# EAGLE board SnowMaker_V1.0 (EAGLE 8.3.2), part 1 of 3
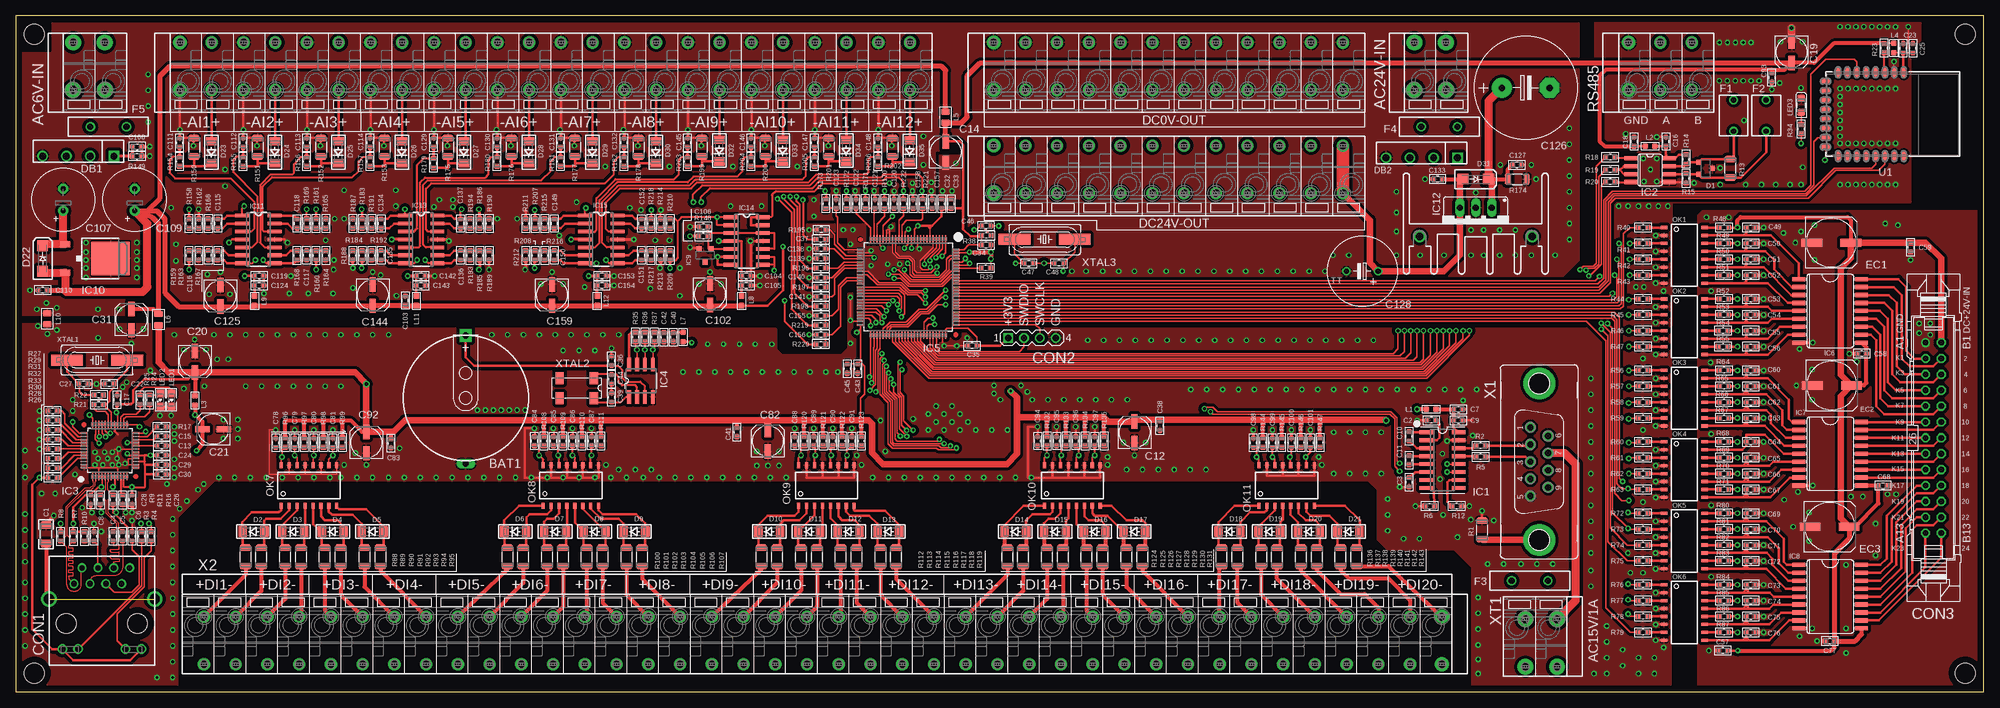
[diagram p7: board, top side]
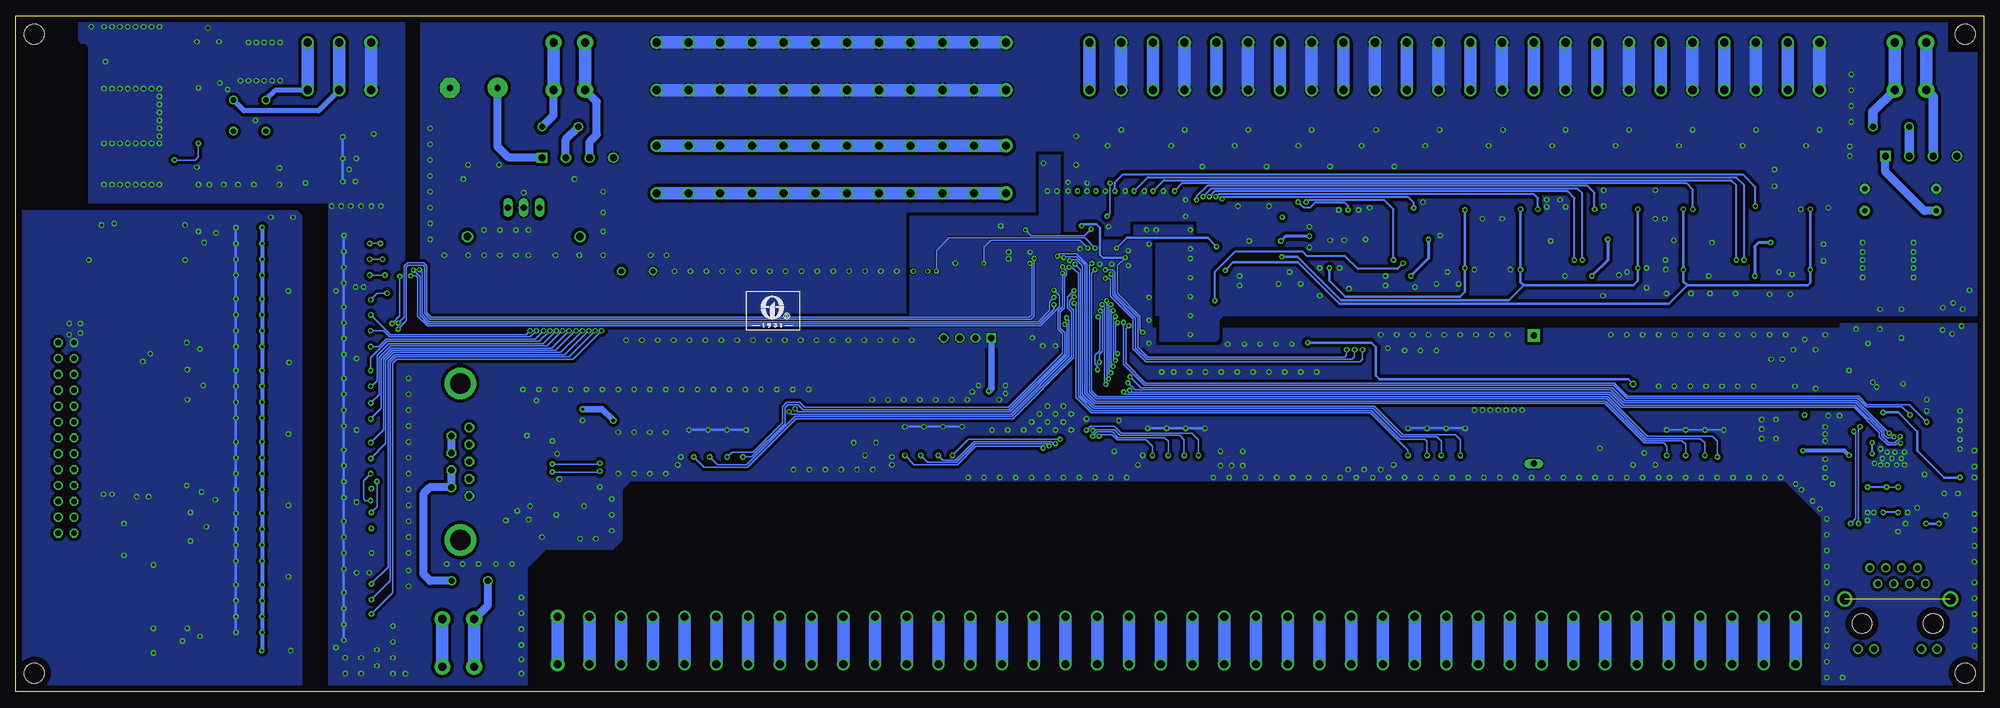
[diagram p8: board, bottom side, seen from below]

Size 315 x 108.2 mm. Coordinates in mm from the lower left corner, seen from the top.
Copper layers (1*16): Top 0.035mm / dielectric 1.5mm / Bottom 0.035mm
Design rules "default *": minimum track width 6mil, minimum drill 0.35mm, track to track 6mil, track to pad 6mil, pad to pad 6mil, via to via 6mil, smd to smd 6mil, copper to edge 40mil, drill to drill 6mil, minimum pad ring 10mil, minimum via ring 8mil, stop-mask expansion 4mil, vias tented up to drill 20mil, thermal gap 10mil

## Footprints (pad centres in the part's own frame; a part is rotated, then mirrored left to right if it is on the bottom)
CR2032-HF = drill 1 pad 1.93 square: B+ 10,0 | drill 1 long: B- -10.5,0
C1206 = smd 1.21 x 1.82: 1 -1.45,0; 2 1.45,0
C0603 = smd 0.8 x 0.75: 1 -0.75,0; 2 0.75,0
UD-5X5,8_NICHICON = smd 2.3 x 1: + 1.725,0; - -1.7,0
E3,5-10 = drill 0.813 pad 1.6: + -1.778,0 | drill 0.813 pad 1.6 octagon: - 1.778,0
E7,5-16 = drill 1.016 pad 3.15: + -3.81,0 | drill 1.016 pad 3.15 octagon: - 3.81,0
TT5D11 = drill 0.813: + -2.54,0 | drill 0.813 octagon: - 2.54,0
HY951180A = drill 0.89: 1 4.445,-6.35; 2 3.175,-8.89; 3 1.905,-6.35; 4 0.635,-8.89; 5 -0.635,-6.35; 6 -1.905,-8.89; 7 -3.175,-6.35; 8 -4.445,-8.89 | drill 1.02: 9 6.325,4.11; 10 3.785,4.11; 11 -3.785,4.11; 12 -6.325,4.11 | drill 1.63: SS@1 -8.45,-3.9; SS@2 8.45,-3.9 | hole 3.2: -5.715,0; 5.715,0
PINHEAD-4P = drill 1.016 square: 1 -3.81,0 | drill 1.016: 2 -1.27,0; 3 1.27,0; 4 3.81,0
26V = drill 0.914: A1 -15.24,-1.27 | drill 0.914 octagon: A2 -12.7,-1.27; A3 -10.16,-1.27; A4 -7.62,-1.27; A5 -5.08,-1.27; A6 -2.54,-1.27; A7 0,-1.27; A8 2.54,-1.27; A9 5.08,-1.27; A10 7.62,-1.27; A11 10.16,-1.27; A12 12.7,-1.27; A13 15.24,-1.27; B1 -15.24,1.27; B2 -12.7,1.27; B3 -10.16,1.27; B4 -7.62,1.27; B5 -5.08,1.27; B6 -2.54,1.27; B7 0,1.27; B8 2.54,1.27; B9 5.08,1.27; B10 7.62,1.27; B11 10.16,1.27; B12 12.7,1.27; B13 15.24,1.27
SOT23-3 = smd 0.78 x 0.78: 1 -0.95,-1.1; 2 0.95,-1.1; 3 0,1.1
MINI_MELF(LL-34) = smd 1.3 x 1.7: A 1.75,0; C -1.75,0
SMA-DO214AC = smd 1.8 x 1.7: A -2.05,0; C 2.05,0
KBP2005 = drill 1.1: AC1 -1.905,0; AC2 1.905,0; DC- 5.715,0 | drill 1.1 square: DC+ -5.715,0
UD-8X10_NICHICON = smd 3.3 x 1.3: + 3.125,0; - -3.125,0
TRF250-120T = drill 0.85: 1 -2.5,0; 2 2.5,0
RXEF110 = drill 1: 1 -2.9,0; 2 2.9,0
HS_TO-220-B = drill 1.2: SS@1 -9,2.1; SS@2 9,2.1
SO16 = smd 0.6 x 2.2: 1 -4.445,-2.6; 2 -3.175,-2.6; 3 -1.905,-2.6; 4 -0.635,-2.6; 5 0.635,-2.6; 6 1.905,-2.6; 7 3.175,-2.6; 8 4.445,-2.6; 9 4.445,2.6; 10 3.175,2.6; 11 1.905,2.6; 12 0.635,2.6; 13 -0.635,2.6; 14 -1.905,2.6; 15 -3.175,2.6; 16 -4.445,2.6
SO08 = smd 0.66 x 2.032: 1 -1.905,-3.073; 2 -0.635,-3.073; 3 0.635,-3.073; 4 1.905,-3.073; 5 1.905,3.073; 6 0.635,3.073; 7 -0.635,3.073; 8 -1.905,3.073
LQFP48_7X7_0.5P = smd 0.3 x 1.26: 1 -2.75,-4.13; 2 -2.25,-4.13; 3 -1.75,-4.13; 4 -1.25,-4.13; 5 -0.75,-4.13; 6 -0.25,-4.13; 7 0.25,-4.13; 8 0.75,-4.13; 9 1.25,-4.13; 10 1.75,-4.13; 11 2.25,-4.13; 12 2.75,-4.13; 25 2.75,4.13; 26 2.25,4.13; 27 1.75,4.13; 28 1.25,4.13; 29 0.75,4.13; 30 0.25,4.13; 31 -0.25,4.13; 32 -0.75,4.13; 33 -1.25,4.13; 34 -1.75,4.13; 35 -2.25,4.13; 36 -2.75,4.13 | smd 1.26 x 0.3: 13 4.13,-2.75; 14 4.13,-2.25; 15 4.13,-1.75; 16 4.13,-1.25; 17 4.13,-0.75; 18 4.13,-0.25; 19 4.13,0.25; 20 4.13,0.75; 21 4.13,1.25; 22 4.13,1.75; 23 4.13,2.25; 24 4.13,2.75; 37 -4.13,2.75; 38 -4.13,2.25; 39 -4.13,1.75; 40 -4.13,1.25; 41 -4.13,0.75; 42 -4.13,0.25; 43 -4.13,-0.25; 44 -4.13,-0.75; 45 -4.13,-1.25; 46 -4.13,-1.75; 47 -4.13,-2.25; 48 -4.13,-2.75
SOIC-8 = smd 0.6 x 2.2: 1 -1.905,-2.6; 2 -0.635,-2.6; 3 0.635,-2.6; 4 1.905,-2.6; 5 1.905,2.6; 6 0.635,2.6; 7 -0.635,2.6; 8 -1.905,2.6
LQFP100_14X14MM = smd 0.3 x 1.26: 1 -6,-7.63; 2 -5.5,-7.63; 3 -5,-7.63; 4 -4.5,-7.63; 5 -4,-7.63; 6 -3.5,-7.63; 7 -3,-7.63; 8 -2.5,-7.63; 9 -2,-7.63; 10 -1.5,-7.63; 11 -1,-7.63; 12 -0.5,-7.63; 13 0,-7.63; 14 0.5,-7.63; 15 1,-7.63; 16 1.5,-7.63; 17 2,-7.63; 18 2.5,-7.63; 19 3,-7.63; 20 3.5,-7.63; 21 4,-7.63; 22 4.5,-7.63; 23 5,-7.63; 24 5.5,-7.63; 25 6,-7.63; 51 6,7.63; 52 5.5,7.63; 53 5,7.63; 54 4.5,7.63; 55 4,7.63; 56 3.5,7.63; 57 3,7.63; 58 2.5,7.63; 59 2,7.63; 60 1.5,7.63; 61 1,7.63; 62 0.5,7.63; 63 0,7.63; 64 -0.5,7.63; 65 -1,7.63; 66 -1.5,7.63; 67 -2,7.63; 68 -2.5,7.63; 69 -3,7.63; 70 -3.5,7.63; 71 -4,7.63; 72 -4.5,7.63; 73 -5,7.63; 74 -5.5,7.63; 75 -6,7.63 | smd 1.26 x 0.3: 26 7.63,-6; 27 7.63,-5.5; 28 7.63,-5; 29 7.63,-4.5; 30 7.63,-4; 31 7.63,-3.5; 32 7.63,-3; 33 7.63,-2.5; 34 7.63,-2; 35 7.63,-1.5; 36 7.63,-1; 37 7.63,-0.5; 38 7.63,0; 39 7.63,0.5; 40 7.63,1; 41 7.63,1.5; 42 7.63,2; 43 7.63,2.5; 44 7.63,3; 45 7.63,3.5; 46 7.63,4; 47 7.63,4.5; 48 7.63,5; 49 7.63,5.5; 50 7.63,6; 76 -7.63,6; 77 -7.63,5.5; 78 -7.63,5; 79 -7.63,4.5; 80 -7.63,4; 81 -7.63,3.5; 82 -7.63,3; 83 -7.63,2.5; 84 -7.63,2; 85 -7.63,1.5; 86 -7.63,1; 87 -7.63,0.5; 88 -7.63,0; 89 -7.63,-0.5; 90 -7.63,-1; 91 -7.63,-1.5; 92 -7.63,-2; 93 -7.63,-2.5; 94 -7.63,-3; 95 -7.63,-3.5; 96 -7.63,-4; 97 -7.63,-4.5; 98 -7.63,-5; 99 -7.63,-5.5; 100 -7.63,-6
SO18W = smd 0.66 x 2.032: 1 -5.08,-5.029; 2 -3.81,-5.029; 3 -2.54,-5.029; 4 -1.27,-5.029; 5 0,-5.029; 6 1.27,-5.029; 7 2.54,-5.029; 8 3.81,-5.029; 9 5.08,-5.029; 10 5.08,5.029; 11 3.81,5.029; 12 2.54,5.029; 13 1.27,5.029; 14 0,5.029; 15 -1.27,5.029; 16 -2.54,5.029; 17 -3.81,5.029; 18 -5.08,5.029
TO252 = smd 1 x 1.6: 1 -2.28,-4.8; 2 2.28,-4.8 | smd 5.4 x 6.2: 3 0,2.5
SOIC-14 = smd 0.6 x 2.2: 1 -3.81,-2.6; 2 -2.54,-2.6; 3 -1.27,-2.6; 4 0,-2.6; 5 1.27,-2.6; 6 2.54,-2.6; 7 3.81,-2.6; 8 3.81,2.6; 9 2.54,2.6; 10 1.27,2.6; 11 0,2.6; 12 -1.27,2.6; 13 -2.54,2.6; 14 -3.81,2.6
78XXS = drill 1.016 long: GND 0,-2.54; IN -2.54,-2.54; OUT 2.54,-2.54
L0603 = smd 0.889 x 0.889: 1 -0.762,0; 2 0.762,0
L0805 = smd 1.016 x 1.397: 1 -0.889,0; 2 0.889,0
SML0805 = smd 1.2 x 1.2: A 1.05,0; C -1.05,0
LED0805 = smd 1.15 x 1.3: A 1.125,0; C -1.125,0
MINI-FLAT-16 = smd 1 x 0.5: 1 -3.24,4.445; 2 -3.24,3.175; 3 -3.24,1.905; 4 -3.24,0.635; 5 -3.24,-0.635; 6 -3.24,-1.905; 7 -3.24,-3.175; 8 -3.24,-4.445; 9 3.24,-4.445; 10 3.24,-3.175; 11 3.24,-1.905; 12 3.24,-0.635; 13 3.24,0.635; 14 3.24,1.905; 15 3.24,3.175; 16 3.24,4.445
R1206 = smd 1.05 x 1.77: 1 -1.485,0; 2 1.485,0
R0603 = smd 0.89 x 0.96: 1 -0.755,0; 2 0.755,0
LQ-BTM2540 = smd 1.6 x 0.8: 1 -6.687,1.758; 2 -6.687,0.258; 3 -6.687,-1.242; 4 -6.687,-2.743; 5 -6.687,-4.242; 6 -6.687,-5.742; 7 -6.687,-7.242; 8 -6.687,-8.742; 17 6.713,-8.742; 18 6.713,-7.242; 19 6.713,-5.742; 20 6.713,-4.242; 21 6.713,-2.743; 22 6.713,-1.242; 23 6.713,0.258; 24 6.713,1.758 | smd 0.8 x 1.6: 9 -5.249,-10.742; 10 -3.749,-10.742; 11 -2.249,-10.742; 12 -0.749,-10.742; 13 0.751,-10.742; 14 2.251,-10.742; 15 3.751,-10.742; 16 5.251,-10.742
SNOWMAKER_V1_OUTLINE = hole 3.2: 3,3; 3,105.2; 312,105.2; 312,3
F09VP = drill 1.016 octagon: 1 5.486,1.422; 2 2.743,1.422; 3 0,1.422; 4 -2.743,1.422; 5 -5.486,1.422; 6 4.115,-1.422; 7 1.372,-1.422; 8 -1.372,-1.422; 9 -4.115,-1.422 | drill 3.302 pad 5.08: G1 -12.522,0; G2 12.522,0
FFKDS/V1-5,08-1_FIRST = drill 1.3: 1@1 0.96,2.77; 2@1 0.96,-4.85
FFKDS/V1-5,08-1_MIDDLE = drill 1.3: 1@1 0.96,2.77; 2@1 0.96,-4.85
FFKDS/V1-5,08-1_LAST = drill 1.3 pad 2.184: 1@1 0.96,2.77; 2@1 0.96,-4.85
FFKDS/V1-5.08-2 = drill 1.3 pad 2.54: 1@1 -1.58,2.77; 1@2 -1.58,-4.85; 2@1 3.5,2.77; 2@2 3.5,-4.85
FFKDS/V1-5.08-3 = drill 1.3: 1@1 0.96,2.77; 1@2 0.96,-4.85; 2@1 6.04,2.77; 2@2 6.04,-4.85 | drill 1.3 pad 2.184: 3@1 11.12,2.77; 3@2 11.12,-4.85
SM49 = smd 5.08 x 1.778: 1 -4.826,0; 2 4.826,0
MC306 = smd 1.3 x 1.9: 1 -2.75,-1.6; 2 2.75,-1.6; 3 2.75,1.6; 4 -2.75,1.6

## Placement (x,y rotation side)
BAT1  CR2032/1HF  [CR2032-HF]  72.03,47.02 90 top
C1  1nF/2kV  [C1206]  4.87,25.22 90 top
C2  100nF/50V  [C0603]  226.57,43.43 180 top
C3  100nF/50V  [C0603]  223.01,33.53 270 top
C4  6.8nF/50V  [C0603]  15.59,24.89 90 top
C5  6.8nF/50V  [C0603]  17.11,24.89 90 top
C6  10nF/50V  [C0603]  18.63,24.89 90 top
C7  10uF/16V  [C0603]  230.89,45.21 0 top
C8  22nF/50V  [C0603]  12.54,24.89 90 top
C9  100nF/50V  [C0603]  230.89,43.43 0 top
C10  100nF/50V  [C0603]  223.01,40.89 90 top
C11  100nF/50V  [C0603]  223.01,37.08 90 top
C12  100uF/6.3V 5x5.8  [UD-5X5,8_NICHICON]  179.07,41.53 90 top
C13  4.7uF/10V  [C0603]  23.37,39.37 0 top
C14  100uF/6.3V 5x5.8  [UD-5X5,8_NICHICON]  148.84,86.36 90 top
C15  10nF/50V  [C0603]  23.37,40.89 0 top
C16  100nF/50V  [C0603]  264.11,88.06 90 top
C17  100nF/50V  [C0603]  16.26,46.74 90 top
C18  100nF/50V  [C0603]  259.03,88.06 90 top
C19  100uF/6.3V 5x5.8  [UD-5X5,8_NICHICON]  284.23,102.36 270 top
C20  100uF/6.3V 5x5.8  [UD-5X5,8_NICHICON]  28.7,52.83 270 top
C21  100uF/6.3V 5x5.8  [UD-5X5,8_NICHICON]  31.62,42.04 180 top
C22  18pF/50V  [C0603]  14.95,49.28 180 top
C23  10uF/16V  [C0603]  302.1,103 90 top
C24  100nF/50V  [C0603]  23.37,37.85 0 top
C25  100nF/50V  [C0603]  303.62,103 90 top
C26  100nF/50V  [C0603]  18.63,30.73 270 top
C27  18pF/50V  [C0603]  10.89,49.28 0 top
C28  100nF/50V  [C0603]  12.03,30.73 270 top
C29  100nF/50V  [C0603]  23.37,36.32 0 top
C30  10uF/16V  [C0603]  23.37,34.8 0 top
C31  100uF/6.3V 5x5.8  [UD-5X5,8_NICHICON]  18.54,59.56 90 top
C32  100nF/50V  [C0603]  148.21,78.11 90 top
C33  100nF/50V  [C0603]  149.73,78.11 90 top
C34  100nF/50V  [C0603]  155.32,71.5 0 top
C35  100nF/50V  [C0603]  153.07,55.37 180 top
C36  100nF/50V  [C0603]  95.38,52.96 90 top
C37  100nF/50V  [C0603]  128.94,73.91 180 top
C38  100nF/50V  [C0603]  183.13,42.58 270 top
C39  6.8pF/50V/NP0  [C0603]  95.38,47.12 90 top
C40  100nF/50V  [C0603]  105.28,56.77 270 top
C41  100nF/50V  [C0603]  115.44,41.56 270 top
C42  10uF/16V  [C0603]  103.76,56.77 270 top
C43  100nF/50V  [C0603]  134.75,51.72 270 top
C44  6.8pF/50V/NP0  [C0603]  95.38,50.04 270 top
C45  100nF/50V  [C0603]  133.1,51.72 270 top
C46  100nF/50V  [C0603]  155.32,74.55 0 top
C47  18pF/50V/NP0  [C0603]  162.14,68.58 0 top
C48  18pF/50V/NP0  [C0603]  166.97,68.58 180 top
C49  10nF/50V  [C0603]  277.71,74.3 0 top
C50  10nF/50V  [C0603]  277.71,71.75 0 top
C51  10nF/50V  [C0603]  277.71,69.22 0 top
C52  10nF/50V  [C0603]  277.71,66.67 0 top
C53  10nF/50V  [C0603]  277.71,62.87 0 top
C54  10nF/50V  [C0603]  277.71,60.33 0 top
C55  10nF/50V  [C0603]  277.71,57.78 0 top
C56  10nF/50V  [C0603]  277.71,55.24 0 top
C57  100nF/50V  [C0603]  273.21,6.6 180 top
C58  100nF/50V  [C0603]  295.44,54.1 180 top
C59  100nF/50V  [C0603]  303.28,71.12 270 top
C60  10nF/50V  [C0603]  277.71,51.44 0 top
C61  10nF/50V  [C0603]  277.71,48.9 0 top
C62  10nF/50V  [C0603]  277.71,46.35 0 top
C63  10nF/50V  [C0603]  277.71,43.81 0 top
C64  10nF/50V  [C0603]  277.71,40.01 0 top
C65  10nF/50V  [C0603]  277.71,37.47 0 top
C66  10nF/50V  [C0603]  277.71,34.92 0 top
C67  10nF/50V  [C0603]  277.71,32.38 0 top
C68  100nF/50V  [C0603]  298.87,33.02 0 top
C69  10nF/50V  [C0603]  277.71,28.57 0 top
C70  10nF/50V  [C0603]  277.71,26.04 0 top
C71  10nF/50V  [C0603]  277.71,23.5 0 top
C72  10nF/50V  [C0603]  277.71,20.95 0 top
C73  10nF/50V  [C0603]  277.71,17.14 0 top
C74  10nF/50V  [C0603]  277.71,14.61 0 top
C75  10nF/50V  [C0603]  277.71,12.06 0 top
C76  10nF/50V  [C0603]  277.71,9.53 0 top
C77  100nF/50V  [C0603]  290.32,8.13 180 top
C78  10nF/50V  [C0603]  41.62,39.88 90 top
C79  10nF/50V  [C0603]  44.67,39.88 90 top
C80  10nF/50V  [C0603]  47.72,39.88 90 top
C81  10nF/50V  [C0603]  50.77,39.88 90 top
C82  100uF/6.3V 5x5.8  [UD-5X5,8_NICHICON]  120.4,40.13 90 top
C83  10nF/50V  [C0603]  60.07,39.75 270 top
C84  10nF/50V  [C0603]  83.02,40.13 90 top
C85  10nF/50V  [C0603]  86.07,40.13 90 top
C86  10nF/50V  [C0603]  89.12,40.13 90 top
C87  10nF/50V  [C0603]  92.17,40.13 90 top
C88  10nF/50V  [C0603]  124.68,40.13 90 top
C89  10nF/50V  [C0603]  127.73,40.13 90 top
C90  10nF/50V  [C0603]  130.78,40.13 90 top
C91  10nF/50V  [C0603]  133.82,40.13 90 top
C92  100uF/6.3V 5x5.8  [UD-5X5,8_NICHICON]  56.13,39.88 90 top
C93  10nF/50V  [C0603]  281.05,98.3 270 top
C94  10nF/50V  [C0603]  163.54,40.13 90 top
C95  10nF/50V  [C0603]  166.59,40.13 90 top
C96  10nF/50V  [C0603]  169.64,40.13 90 top
C97  10nF/50V  [C0603]  172.69,40.13 90 top
C98  10nF/50V  [C0603]  198.09,39.88 90 top
C99  10nF/50V  [C0603]  201.13,39.88 90 top
C100  10nF/50V  [C0603]  204.18,39.88 90 top
C101  10nF/50V  [C0603]  207.23,39.88 90 top
C102  47uF/6.3V 5x5.8  [UD-5X5,8_NICHICON]  111.12,63.63 270 top
C103  10nF/50V  [C0603]  62.36,62.61 90 top
C104  100nF/50V  [C0603]  116.93,66.55 0 top
C105  10uF/16V  [C0603]  116.93,65.02 0 top
C106  100nF/50V  [C0603]  110.07,74.42 180 top
C107  1000uF/16V_M10*16  [E3,5-10]  7.62,78.74 90 top
C108  100nF/50V  [C0603]  19.43,87.25 0 top
C109  220uF/16V_M10*16  [E3,5-10]  19.05,78.74 90 top
C110  100nF/50V  [C0603]  4.32,64.26 180 top
C111  100nF/50V  [C0603]  26.25,87.88 90 top
C112  100nF/50V  [C0603]  36.41,87.88 90 top
C113  100nF/50V  [C0603]  46.57,87.88 90 top
C114  100nF/50V  [C0603]  56.73,87.88 90 top
C115  30pF/50V  [C0603]  32.35,74.93 270 top
C116  30pF/50V  [C0603]  30.83,69.85 90 top
C117  30pF/50V  [C0603]  46.57,69.85 90 top
C118  30pF/50V  [C0603]  45.05,74.93 270 top
C119  100nF/50V  [C0603]  38.95,66.55 0 top
C120  1nF/50V  [C0603]  140.59,78.11 90 top
C121  1nF/50V  [C0603]  137.54,78.11 90 top
C122  1nF/50V  [C0603]  134.49,78.11 90 top
C123  1nF/50V  [C0603]  131.32,78.11 90 top
C124  10uF/16V  [C0603]  38.95,65.02 0 top
C125  47uF/6.3V 5x5.8  [UD-5X5,8_NICHICON]  32.77,63.37 270 top
C126  2200uF/50V_M16*25  [E7,5-16]  241.68,96.65 0 top
C127  100nF/50V  [C0603]  240.28,84.33 0 top
C128  [TT5D11]  215.52,67.31 180 top
C129  100nF/50V  [C0603]  66.89,87.88 90 top
C130  100nF/50V  [C0603]  77.05,87.88 90 top
C131  100nF/50V  [C0603]  87.21,87.88 90 top
C132  100nF/50V  [C0603]  97.37,87.88 90 top
C133  100nF/50V  [C0603]  227.58,82.04 180 top
C134  30pF/50V  [C0603]  58.51,74.93 270 top
C135  30pF/50V  [C0603]  58.51,69.85 90 top
C136  30pF/50V  [C0603]  71.21,69.85 90 top
C137  30pF/50V  [C0603]  71.21,74.93 270 top
C138  1nF/50V  [C0603]  128.87,70.87 180 top
C139  1nF/50V  [C0603]  128.87,69.34 180 top
C140  1nF/50V  [C0603]  128.87,66.29 180 top
C141  1nF/50V  [C0603]  128.87,63.25 180 top
C142  100nF/50V  [C0603]  64.86,66.55 0 top
C143  10uF/16V  [C0603]  64.86,65.02 0 top
C144  47uF/6.3V 5x5.8  [UD-5X5,8_NICHICON]  57.15,63.5 270 top
C145  100nF/50V  [C0603]  107.53,87.88 90 top
C146  100nF/50V  [C0603]  117.69,87.88 90 top
C147  100nF/50V  [C0603]  127.85,87.88 90 top
C148  100nF/50V  [C0603]  138.01,87.88 90 top
C149  30pF/50V  [C0603]  86.2,74.93 270 top
C150  30pF/50V  [C0603]  86.2,69.85 90 top
C151  30pF/50V  [C0603]  100.17,69.85 90 top
C152  30pF/50V  [C0603]  100.17,74.93 270 top
C153  100nF/50V  [C0603]  93.82,66.55 0 top
C154  10uF/16V  [C0603]  93.82,65.02 0 top
C155  1nF/50V  [C0603]  128.87,60.2 180 top
C156  1nF/50V  [C0603]  128.87,57.15 180 top
C157  1nF/50V  [C0603]  146.69,78.11 90 top
C158  1nF/50V  [C0603]  143.64,78.11 90 top
C159  47uF/6.3V 5x5.8  [UD-5X5,8_NICHICON]  85.85,63.5 270 top
CON1  HR951180A  [HY951180A]  13.8,10.95 180 top
CON2  SWJ  [PINHEAD-4P]  162.65,56.64 0 top
CON3  [26V]  306.92,40.64 270 top
D1  SM712-02H  [SOT23-3]  270.46,83.77 270 top
D2  1N4148  [MINI_MELF(LL-34)]  38.06,25.65 0 top
D3  1N4148  [MINI_MELF(LL-34)]  44.41,25.65 0 top
D4  1N4148  [MINI_MELF(LL-34)]  50.77,25.65 0 top
D5  1N4148  [MINI_MELF(LL-34)]  57.12,25.65 0 top
D6  1N4148  [MINI_MELF(LL-34)]  79.97,25.65 0 top
D7  1N4148  [MINI_MELF(LL-34)]  86.33,25.65 0 top
D8  1N4148  [MINI_MELF(LL-34)]  92.67,25.65 0 top
D9  1N4148  [MINI_MELF(LL-34)]  99.03,25.65 0 top
D10  1N4148  [MINI_MELF(LL-34)]  120.61,25.65 0 top
D11  1N4148  [MINI_MELF(LL-34)]  126.97,25.65 0 top
D12  1N4148  [MINI_MELF(LL-34)]  133.31,25.65 0 top
D13  1N4148  [MINI_MELF(LL-34)]  139.66,25.65 0 top
D14  1N4148  [MINI_MELF(LL-34)]  159.99,25.65 0 top
D15  1N4148  [MINI_MELF(LL-34)]  166.34,25.65 0 top
D16  1N4148  [MINI_MELF(LL-34)]  172.69,25.65 0 top
D17  1N4148  [MINI_MELF(LL-34)]  179.03,25.65 0 top
D18  1N4148  [MINI_MELF(LL-34)]  194.28,25.65 0 top
D19  1N4148  [MINI_MELF(LL-34)]  200.62,25.65 0 top
D20  1N4148  [MINI_MELF(LL-34)]  206.97,25.65 0 top
D21  1N4148  [MINI_MELF(LL-34)]  213.32,25.65 0 top
D22  1N4007  [SMA-DO214AC]  4.32,69.34 90 top
D23  1N4148  [MINI_MELF(LL-34)]  31.33,86.36 90 top
D24  1N4148  [MINI_MELF(LL-34)]  41.49,86.36 90 top
D25  1N4148  [MINI_MELF(LL-34)]  51.65,86.36 90 top
D26  1N4148  [MINI_MELF(LL-34)]  61.81,86.36 90 top
D27  1N4148  [MINI_MELF(LL-34)]  71.72,86.36 90 top
D28  1N4148  [MINI_MELF(LL-34)]  82.13,86.36 90 top
D29  1N4148  [MINI_MELF(LL-34)]  92.29,86.36 90 top
D30  1N4148  [MINI_MELF(LL-34)]  102.45,86.36 90 top
D31  1N4007  [SMA-DO214AC]  233.68,82.04 0 top
D32  1N4148  [MINI_MELF(LL-34)]  112.61,86.61 90 top
D33  1N4148  [MINI_MELF(LL-34)]  122.77,86.61 90 top
D34  1N4148  [MINI_MELF(LL-34)]  132.93,86.61 90 top
D35  1N4148  [MINI_MELF(LL-34)]  143.09,86.49 90 top
DB1  KBP2005G  [KBP2005]  10.03,85.72 180 top
DB2  KBP2005G  [KBP2005]  225.04,85.47 180 top
EC1  220uF/50V  [UD-8X10_NICHICON]  290.58,71.88 0 top
EC2  220uF/50V  [UD-8X10_NICHICON]  290.67,49.02 0 top
EC3  220uF/50V  [UD-8X10_NICHICON]  290.32,26.42 0 top
F1  TRF250-120T  [TRF250-120T]  274.95,92.2 270 top
F2  TRF250-120T  [TRF250-120T]  280.16,92.2 270 top
F3  RXEF110  [RXEF110]  242.32,17.78 0 top
F4  RXEF110  [RXEF110]  227.84,90.42 180 top
F5  RXEF110  [RXEF110]  14.86,90.42 180 top
HS1  HEATSINK  [HS_TO-220-B]  233.68,74.93 180 top
IC1  ST3232BD  [SO16]  228.35,37.08 270 top
IC2  ST3485EBD  [SO08]  261.57,83.48 270 top
IC3  W5500  [LQFP48_7X7_0.5P]  15.08,38.61 0 top
IC4  SD2068  [SOIC-8]  100.08,49.78 0 top
IC5  STM32F103VCT6  [LQFP100_14X14MM]  142.84,64.77 180 top
IC6  ULN2803  [SO18W]  290.41,60.96 270 top
IC7  ULN2803  [SO18W]  290.41,38.1 270 top
IC8  ULN2803  [SO18W]  290.41,15.24 270 top
IC9  LM4040AIM3X-2.5  [SOT23-3]  110.33,69.85 180 top
IC10  LM1117IDTX-3.3  [TO252]  12.7,69.34 270 top
IC11  SGM8584XS14  [SOIC-14]  38.87,72.39 270 top
IC12  LM78M24  [78XXS]  233.68,74.93 180 top
IC13  SGM8584XS14  [SOIC-14]  64.91,72.39 270 top
IC14  SGM8584XS14  [SOIC-14]  117,72.14 270 top
IC15  SGM8584XS14  [SOIC-14]  93.75,72.39 270 top
L1  600R/100MHz  [L0603]  226.57,45.21 180 top
L2  600R/100MHz  [L0603]  261.57,87.29 180 top
L3  100R/100MHz 3A  [L0603]  28.7,46.61 270 top
L4  600R/100MHz  [L0603]  300.57,103 270 top
L5  100R/100MHz  [L0805]  148.84,91.95 270 top
L6  100R/100MHz  [L0805]  22.86,59.56 270 top
L7  600R/100MHz  [L0603]  106.81,56.77 90 top
L8  10uH  [L0603]  116.2,62.58 270 top
L9  10uH  [L0603]  38.23,62.58 90 top
L10  100R/100MHz  [L0805]  5.04,59.69 90 top
L11  10uH  [L0603]  64.14,62.58 90 top
L12  10uH  [L0603]  93.09,62.58 90 top
LED1  [SML0805]  24.94,46.7 90 top
LED2  [SML0805]  23.16,46.7 90 top
LED3  [LED0805]  285.75,93.85 270 top
LOGO1  SY-LOGO_BOTTOM  [SY-LOGO_BOTTOM]  193.77,61.34 0 top
OK1  TLP283-4  [MINI-FLAT-16]  267.05,69.85 0 top
OK2  TLP283-4  [MINI-FLAT-16]  267.05,58.42 0 top
OK3  TLP283-4  [MINI-FLAT-16]  267.05,46.99 0 top
OK4  TLP283-4  [MINI-FLAT-16]  267.05,35.56 0 top
OK5  TLP283-4  [MINI-FLAT-16]  267.05,24.13 0 top
OK6  TLP283-4  [MINI-FLAT-16]  267.05,12.7 0 top
OK7  TLP283-4  [MINI-FLAT-16]  46.95,33.02 90 top
OK8  TLP283-4  [MINI-FLAT-16]  88.86,33.02 90 top
OK9  TLP283-4  [MINI-FLAT-16]  129.76,33.02 90 top
OK10  TLP283-4  [MINI-FLAT-16]  169.13,33.02 90 top
OK11  TLP283-4  [MINI-FLAT-16]  203.42,33.02 90 top
R1  0R  [R1206]  234.7,25.91 270 top
R2  22R  [R0603]  234.44,39.37 180 top
R3  330R  [R0603]  20.16,24.89 90 top
R4  330R  [R0603]  21.68,24.89 90 top
R5  22R  [R0603]  234.44,37.59 180 top
R6  10k  [R0603]  226.31,29.72 0 top
R7  49R9  [R0603]  9.24,24.89 270 top
R8  49R9  [R0603]  7.2,24.89 270 top
R9  49R9  [R0603]  13.55,30.73 270 top
R10  10R  [R0603]  11.01,24.89 90 top
R11  49R9  [R0603]  15.59,30.73 270 top
R12  10k  [R0603]  230.63,29.72 180 top
R13  120R  [R1206]  274.4,83.77 90 top
R14  2.4k  [R0603]  267.33,85.22 90 top
R15  2.4k  [R0603]  267.33,82.18 90 top
R16  12.4k/1%  [R0603]  17.11,30.73 270 top
R17  10k  [R0603]  23.37,42.42 180 top
R18  0R  [R0603]  255.21,85.54 180 top
R19  0R  [R0603]  255.21,83.51 180 top
R20  0R  [R0603]  255.21,81.6 180 top
R21  1M  [R0603]  13.3,45.97 180 top
R22  0R  [R0603]  13.3,47.5 0 top
R23  10k  [R0603]  299.05,103 90 top
R24  330R  [R0603]  21.43,46.74 270 top
R25  330R  [R0603]  19.9,46.74 270 top
R26  10k  [R0603]  5.93,34.29 180 top
R27  10k  [R0603]  5.93,44.96 0 top
R28  10k  [R0603]  5.93,35.81 180 top
R29  10k  [R0603]  5.93,43.43 0 top
R30  10k  [R0603]  5.93,37.34 180 top
R31  10k  [R0603]  5.93,41.91 0 top
R32  10k  [R0603]  5.93,40.39 0 top
R33  10k  [R0603]  5.93,38.86 0 top
R34  1k  [R0603]  285.75,90.04 90 top
R35  10k  [R0603]  99.19,56.77 270 top
R36  10k  [R0603]  100.71,56.77 270 top
R37  10k  [R0603]  102.23,56.77 270 top
R38  10k  [R0603]  155.32,73.03 180 top
R39  10k  [R0603]  155.29,67.82 180 top
R40  330R  [R0603]  260.44,74.3 180 top
R41  330R  [R0603]  260.44,71.75 180 top
R42  330R  [R0603]  260.44,69.22 180 top
R43  330R  [R0603]  260.44,66.67 180 top
R44  330R  [R0603]  260.44,62.87 180 top
R45  330R  [R0603]  260.44,60.33 180 top
R46  330R  [R0603]  260.44,57.78 180 top
R47  330R  [R0603]  260.44,55.24 180 top
R48  20K  [R0603]  273.4,74.3 180 top
R49  20K  [R0603]  273.4,71.75 180 top
R50  20K  [R0603]  273.4,69.22 180 top
R51  20K  [R0603]  273.4,66.67 180 top
R52  20K  [R0603]  273.4,62.87 180 top
R53  20K  [R0603]  273.4,60.33 180 top
R54  20K  [R0603]  273.27,57.78 180 top
R55  20K  [R0603]  273.27,55.24 180 top
R56  330R  [R0603]  260.44,51.44 180 top
R57  330R  [R0603]  260.44,48.9 180 top
R58  330R  [R0603]  260.44,46.35 180 top
R59  330R  [R0603]  260.44,43.81 180 top
R60  330R  [R0603]  260.44,40.01 180 top
R61  330R  [R0603]  260.44,37.47 180 top
R62  330R  [R0603]  260.44,34.92 180 top
R63  330R  [R0603]  260.44,32.38 180 top
R64  20K  [R0603]  273.4,51.44 180 top
R65  20K  [R0603]  273.4,48.9 180 top
R66  20K  [R0603]  273.4,46.35 180 top
R67  20K  [R0603]  273.4,43.81 180 top
R68  20K  [R0603]  273.4,40.01 180 top
R69  20K  [R0603]  273.4,37.47 180 top
R70  20K  [R0603]  273.4,34.92 180 top
R71  20K  [R0603]  273.4,32.38 180 top
R72  330R  [R0603]  260.44,28.57 180 top
R73  330R  [R0603]  260.44,26.04 180 top
R74  330R  [R0603]  260.44,23.5 180 top
R75  330R  [R0603]  260.44,20.95 180 top
R76  330R  [R0603]  260.44,17.14 180 top
R77  330R  [R0603]  260.44,14.61 180 top
R78  330R  [R0603]  260.44,12.06 180 top
R79  330R  [R0603]  260.44,9.53 180 top
R80  20K  [R0603]  273.4,28.57 180 top
R81  20K  [R0603]  273.4,26.04 180 top
R82  20K  [R0603]  273.4,23.5 180 top
R83  20K  [R0603]  273.4,20.95 180 top
R84  20K  [R0603]  273.4,17.14 180 top
R85  20K  [R0603]  273.4,14.61 180 top
R86  20K  [R0603]  273.4,12.06 180 top
R87  20K  [R0603]  273.4,9.53 180 top
R88  2.2k  [R1206]  36.8,21.59 90 top
R89  2.2k  [R1206]  39.34,21.59 90 top
R90  2.2k  [R1206]  43.15,21.59 90 top
R91  2.2k  [R1206]  45.69,21.59 90 top
R92  2.2k  [R1206]  49.49,21.59 90 top
R93  2.2k  [R1206]  52.03,21.59 90 top
R94  2.2k  [R1206]  55.84,21.59 90 top
R95  2.2k  [R1206]  58.38,21.59 90 top
R96  10K  [R0603]  43.15,39.88 90 top
R97  10K  [R0603]  46.19,39.88 90 top
R98  10K  [R0603]  49.24,39.88 90 top
R99  10K  [R0603]  52.29,39.88 90 top
R100  2.2k  [R1206]  78.7,21.59 90 top
R101  2.2k  [R1206]  81.25,21.59 90 top
R102  2.2k  [R1206]  85.06,21.59 90 top
R103  2.2k  [R1206]  87.59,21.59 90 top
R104  2.2k  [R1206]  91.41,21.59 90 top
R105  2.2k  [R1206]  93.94,21.59 90 top
R106  2.2k  [R1206]  97.75,21.59 90 top
R107  2.2k  [R1206]  100.3,21.59 90 top
R108  10K  [R0603]  84.55,40.13 90 top
R109  10K  [R0603]  87.59,40.13 90 top
R110  10K  [R0603]  90.64,40.13 90 top
R111  10K  [R0603]  93.69,40.13 90 top
R112  2.2k  [R1206]  119.34,21.59 90 top
R113  2.2k  [R1206]  121.89,21.59 90 top
R114  2.2k  [R1206]  125.69,21.59 90 top
R115  2.2k  [R1206]  128.24,21.59 90 top
R116  2.2k  [R1206]  132.04,21.59 90 top
R117  2.2k  [R1206]  134.59,21.59 90 top
R118  2.2k  [R1206]  138.4,21.59 90 top
R119  2.2k  [R1206]  140.94,21.59 90 top
R120  10K  [R0603]  126.2,40.13 90 top
R121  10K  [R0603]  129.25,40.13 90 top
R122  10K  [R0603]  132.3,40.13 90 top
R123  10K  [R0603]  135.35,40.13 90 top
R124  2.2k  [R1206]  158.72,21.59 90 top
R125  2.2k  [R1206]  161.25,21.59 90 top
R126  2.2k  [R1206]  165.06,21.59 90 top
R127  2.2k  [R1206]  167.6,21.59 90 top
R128  2.2k  [R1206]  171.41,21.59 90 top
R129  2.2k  [R1206]  173.96,21.59 90 top
R130  2.2k  [R1206]  177.76,21.59 90 top
R131  2.2k  [R1206]  180.31,21.59 90 top
R132  10K  [R0603]  165.06,40.13 90 top
R133  10K  [R0603]  168.11,40.13 90 top
R134  10K  [R0603]  171.16,40.13 90 top
R135  10K  [R0603]  174.21,40.13 90 top
R136  2.2k  [R1206]  193,21.59 90 top
R137  2.2k  [R1206]  195.54,21.59 90 top
R138  2.2k  [R1206]  199.35,21.59 90 top
R139  2.2k  [R1206]  201.9,21.59 90 top
R140  2.2k  [R1206]  205.71,21.59 90 top
R141  2.2k  [R1206]  208.25,21.59 90 top
R142  2.2k  [R1206]  212.06,21.59 90 top
R143  2.2k  [R1206]  214.59,21.59 90 top
R144  10K  [R0603]  199.61,39.88 90 top
R145  10K  [R0603]  202.66,39.88 90 top
R146  10K  [R0603]  205.71,39.88 90 top
R147  10K  [R0603]  208.75,39.88 90 top
R148  10k  [R0603]  110.07,72.9 180 top
R149  10K  [R0603]  19.43,85.72 0 top
R150  120R/0.1%  [R1206]  28.54,87.12 270 top
R151  120R/0.1%  [R1206]  38.7,87.12 270 top
R152  120R/0.1%  [R1206]  48.86,87.12 270 top
R153  120R/0.1%  [R1206]  59.02,87.12 270 top
R154  10k  [R0603]  26.25,84.84 90 top
R155  10k  [R0603]  36.41,84.84 90 top
R156  10k  [R0603]  46.57,84.84 90 top
R157  10k  [R0603]  56.73,84.84 90 top
R158  5.11k/1%  [R0603]  27.78,74.93 90 top
R159  5.11k/1%  [R0603]  27.78,69.85 270 top
R160  5.11k/1%  [R0603]  48.1,69.85 270 top
R161  5.11k/1%  [R0603]  48.1,74.93 90 top
R162  124k/1%  [R0603]  29.3,74.93 270 top
R163  124k/1%  [R0603]  29.3,69.85 90 top
R164  124k/1%  [R0603]  49.62,69.85 90 top
R165  124k/1%  [R0603]  49.62,74.93 270 top
R166  1k/1%  [R0603]  30.83,74.93 90 top
R167  1k/1%  [R0603]  32.35,69.85 270 top
R168  1k/1%  [R0603]  45.05,69.85 90 top
R169  1k/1%  [R0603]  46.57,74.93 270 top
R170  1k  [R0603]  139.06,78.11 270 top
R171  1k  [R0603]  136.02,78.11 270 top
R172  1k  [R0603]  132.97,78.11 270 top
R173  1k  [R0603]  129.67,78.11 270 top
R174  20K  [R1206]  240.32,82.04 0 top
R175  120R/0.1%  [R1206]  69.18,87.12 270 top
R176  120R/0.1%  [R1206]  79.34,87.12 270 top
R177  120R/0.1%  [R1206]  89.5,87.12 270 top
R178  120R/0.1%  [R1206]  99.66,87.12 270 top
R179  10k  [R0603]  66.89,84.58 90 top
R180  10k  [R0603]  77.05,84.84 90 top
R181  10k  [R0603]  87.21,84.84 90 top
R182  10k  [R0603]  97.37,84.84 90 top
R183  5.11k/1%  [R0603]  55.46,74.93 90 top
R184  5.11k/1%  [R0603]  55.46,69.85 270 top
R185  5.11k/1%  [R0603]  74.26,69.85 270 top
R186  5.11k/1%  [R0603]  74.26,74.93 90 top
R187  124k/1%  [R0603]  53.94,74.93 270 top
R188  124k/1%  [R0603]  53.94,69.85 90 top
R189  124k/1%  [R0603]  75.78,69.85 90 top
R190  124k/1%  [R0603]  75.78,74.93 270 top
R191  1k/1%  [R0603]  56.99,74.93 270 top
R192  1k/1%  [R0603]  56.99,69.85 90 top
R193  1k/1%  [R0603]  72.74,69.85 90 top
R194  1k/1%  [R0603]  72.74,74.93 270 top
R195  1k  [R0603]  128.87,72.39 0 top
R196  1k  [R0603]  128.87,67.82 0 top
R197  1k  [R0603]  128.87,64.77 0 top
R198  1k  [R0603]  128.87,61.72 0 top
R199  120R/0.1%  [R1206]  109.82,87.12 270 top
R200  120R/0.1%  [R1206]  119.98,87.12 270 top
R201  120R/0.1%  [R1206]  130.14,87.12 270 top
R202  120R/0.1%  [R1206]  140.3,87.12 270 top
R203  10k  [R0603]  107.53,84.84 90 top
R204  10k  [R0603]  117.69,84.84 90 top
R205  10k  [R0603]  127.85,84.84 90 top
R206  10k  [R0603]  138.01,84.84 90 top
R207  5.11k/1%  [R0603]  83.15,74.93 90 top
R208  5.11k/1%  [R0603]  83.15,69.85 270 top
R209  5.11k/1%  [R0603]  104.74,69.85 270 top
R210  5.11k/1%  [R0603]  104.74,74.93 90 top
R211  124k/1%  [R0603]  81.63,74.93 270 top
R212  124k/1%  [R0603]  81.63,69.85 90 top
R213  124k/1%  [R0603]  103.22,69.85 90 top
R214  124k/1%  [R0603]  103.22,74.93 270 top
R215  1k/1%  [R0603]  84.67,74.93 270 top
R216  1k/1%  [R0603]  84.67,69.85 270 top
R217  1k/1%  [R0603]  101.69,69.85 270 top
R218  1k/1%  [R0603]  101.69,74.93 90 top
R219  1k  [R0603]  128.87,58.67 0 top
R220  1k  [R0603]  128.87,55.63 0 top
R221  1k  [R0603]  145.16,78.11 270 top
R222  1k  [R0603]  142.11,78.11 270 top
U1  LQ-BTM2540  [LQ-BTM2540]  300.41,92.44 270 top
U$1  [SNOWMAKER_V1_OUTLINE]  0,0 0 top
X1  [F09VP]  243.84,36.83 90 top
X2  FFKDS/V1-5.08_FIRST  [FFKDS/V1-5,08-1_FIRST]  29.18,9.27 0 top
X3  FFKDS/V1-5.08_MIDDLE  [FFKDS/V1-5,08-1_MIDDLE]  34.26,9.27 0 top
X4  FFKDS/V1-5.08_MIDDLE  [FFKDS/V1-5,08-1_MIDDLE]  39.34,9.27 0 top
X5  FFKDS/V1-5.08_MIDDLE  [FFKDS/V1-5,08-1_MIDDLE]  44.41,9.27 0 top
X6  FFKDS/V1-5.08_MIDDLE  [FFKDS/V1-5,08-1_MIDDLE]  49.49,9.27 0 top
X7  FFKDS/V1-5.08_MIDDLE  [FFKDS/V1-5,08-1_MIDDLE]  54.58,9.27 0 top
X8  FFKDS/V1-5.08_MIDDLE  [FFKDS/V1-5,08-1_MIDDLE]  59.66,9.27 0 top
X9  FFKDS/V1-5.08_MIDDLE  [FFKDS/V1-5,08-1_MIDDLE]  64.73,9.27 0 top
X10  FFKDS/V1-5.08_MIDDLE  [FFKDS/V1-5,08-1_MIDDLE]  69.81,9.27 0 top
X11  FFKDS/V1-5.08_MIDDLE  [FFKDS/V1-5,08-1_MIDDLE]  74.89,9.27 0 top
X12  FFKDS/V1-5.08_MIDDLE  [FFKDS/V1-5,08-1_MIDDLE]  79.97,9.27 0 top
X13  FFKDS/V1-5.08_MIDDLE  [FFKDS/V1-5,08-1_MIDDLE]  85.06,9.27 0 top
X14  FFKDS/V1-5.08_MIDDLE  [FFKDS/V1-5,08-1_MIDDLE]  90.14,9.27 0 top
X15  FFKDS/V1-5.08_MIDDLE  [FFKDS/V1-5,08-1_MIDDLE]  95.22,9.27 0 top
X16  FFKDS/V1-5.08_MIDDLE  [FFKDS/V1-5,08-1_MIDDLE]  100.3,9.27 0 top
X17  FFKDS/V1-5.08_MIDDLE  [FFKDS/V1-5,08-1_MIDDLE]  105.38,9.27 0 top
X18  FFKDS/V1-5.08_MIDDLE  [FFKDS/V1-5,08-1_MIDDLE]  110.45,9.27 0 top
X19  FFKDS/V1-5.08_MIDDLE  [FFKDS/V1-5,08-1_MIDDLE]  115.53,9.27 0 top
X20  FFKDS/V1-5.08_MIDDLE  [FFKDS/V1-5,08-1_MIDDLE]  120.61,9.27 0 top
X21  FFKDS/V1-5.08_MIDDLE  [FFKDS/V1-5,08-1_MIDDLE]  125.69,9.27 0 top
X22  FFKDS/V1-5.08_MIDDLE  [FFKDS/V1-5,08-1_MIDDLE]  130.78,9.27 0 top
X23  FFKDS/V1-5.08_MIDDLE  [FFKDS/V1-5,08-1_MIDDLE]  135.85,9.27 0 top
X24  FFKDS/V1-5.08_MIDDLE  [FFKDS/V1-5,08-1_MIDDLE]  140.94,9.27 0 top
X25  FFKDS/V1-5.08_MIDDLE  [FFKDS/V1-5,08-1_MIDDLE]  146.01,9.27 0 top
X26  FFKDS/V1-5.08_MIDDLE  [FFKDS/V1-5,08-1_MIDDLE]  151.09,9.27 0 top
X27  FFKDS/V1-5.08_MIDDLE  [FFKDS/V1-5,08-1_MIDDLE]  156.18,9.27 0 top
X28  FFKDS/V1-5.08_MIDDLE  [FFKDS/V1-5,08-1_MIDDLE]  161.25,9.27 0 top
X29  FFKDS/V1-5.08_MIDDLE  [FFKDS/V1-5,08-1_MIDDLE]  166.34,9.27 0 top
X30  FFKDS/V1-5.08_MIDDLE  [FFKDS/V1-5,08-1_MIDDLE]  171.41,9.27 0 top
X31  FFKDS/V1-5.08_MIDDLE  [FFKDS/V1-5,08-1_MIDDLE]  176.5,9.27 0 top
X32  FFKDS/V1-5.08_MIDDLE  [FFKDS/V1-5,08-1_MIDDLE]  181.57,9.27 0 top
X33  FFKDS/V1-5.08_MIDDLE  [FFKDS/V1-5,08-1_MIDDLE]  186.66,9.27 0 top
X34  FFKDS/V1-5.08_MIDDLE  [FFKDS/V1-5,08-1_MIDDLE]  191.74,9.27 0 top
X35  FFKDS/V1-5.08_MIDDLE  [FFKDS/V1-5,08-1_MIDDLE]  196.81,9.27 0 top
X36  FFKDS/V1-5.08_MIDDLE  [FFKDS/V1-5,08-1_MIDDLE]  201.9,9.27 0 top
X37  FFKDS/V1-5.08_MIDDLE  [FFKDS/V1-5,08-1_MIDDLE]  206.97,9.27 0 top
X38  FFKDS/V1-5.08_MIDDLE  [FFKDS/V1-5,08-1_MIDDLE]  212.06,9.27 0 top
X39  FFKDS/V1-5.08_MIDDLE  [FFKDS/V1-5,08-1_MIDDLE]  217.13,9.27 0 top
X40  FFKDS/V1-5.08_MIDDLE  [FFKDS/V1-5,08-1_MIDDLE]  222.22,9.27 0 top
X41  FFKDS/V1-5.08_LAST  [FFKDS/V1-5,08-1_LAST]  227.29,9.27 0 top
X42  FFKDS/V1-5.08_MIDDLE  [FFKDS/V1-5,08-1_MIDDLE]  32.35,99.06 180 top
X43  FFKDS/V1-5.08_LAST  [FFKDS/V1-5,08-1_LAST]  27.27,99.06 180 top
X44  FFKDS/V1-5.08_MIDDLE  [FFKDS/V1-5,08-1_MIDDLE]  42.51,99.06 180 top
X45  FFKDS/V1-5.08_MIDDLE  [FFKDS/V1-5,08-1_MIDDLE]  37.43,99.06 180 top
X46  FFKDS/V1-5.08_MIDDLE  [FFKDS/V1-5,08-1_MIDDLE]  52.67,99.06 180 top
X47  FFKDS/V1-5.08_MIDDLE  [FFKDS/V1-5,08-1_MIDDLE]  47.59,99.06 180 top
X48  FFKDS/V1-5.08_MIDDLE  [FFKDS/V1-5,08-1_MIDDLE]  62.83,99.06 180 top
X49  FFKDS/V1-5.08_MIDDLE  [FFKDS/V1-5,08-1_MIDDLE]  57.75,99.06 180 top
X50  FFKDS/V1-5.08_MIDDLE  [FFKDS/V1-5,08-1_MIDDLE]  72.99,99.06 180 top
X51  FFKDS/V1-5.08_MIDDLE  [FFKDS/V1-5,08-1_MIDDLE]  67.91,99.06 180 top
X52  FFKDS/V1-5.08_MIDDLE  [FFKDS/V1-5,08-1_MIDDLE]  83.15,99.06 180 top
X53  FFKDS/V1-5.08_MIDDLE  [FFKDS/V1-5,08-1_MIDDLE]  78.07,99.06 180 top
X54  FFKDS/V1-5.08_MIDDLE  [FFKDS/V1-5,08-1_MIDDLE]  93.31,99.06 180 top
X55  FFKDS/V1-5.08_MIDDLE  [FFKDS/V1-5,08-1_MIDDLE]  88.23,99.06 180 top
X56  FFKDS/V1-5.08_MIDDLE  [FFKDS/V1-5,08-1_MIDDLE]  103.47,99.06 180 top
X57  FFKDS/V1-5.08_MIDDLE  [FFKDS/V1-5,08-1_MIDDLE]  98.39,99.06 180 top
X58  FFKDS/V1-5.08_FIRST  [FFKDS/V1-5,08-1_FIRST]  213.36,82.55 180 top
X59  FFKDS/V1-5.08_MIDDLE  [FFKDS/V1-5,08-1_MIDDLE]  208.28,82.55 180 top
X60  FFKDS/V1-5.08_MIDDLE  [FFKDS/V1-5,08-1_MIDDLE]  203.2,82.55 180 top
X61  FFKDS/V1-5.08_MIDDLE  [FFKDS/V1-5,08-1_MIDDLE]  198.12,82.55 180 top
X62  FFKDS/V1-5.08_MIDDLE  [FFKDS/V1-5,08-1_MIDDLE]  193.04,82.55 180 top
X63  FFKDS/V1-5.08_MIDDLE  [FFKDS/V1-5,08-1_MIDDLE]  187.96,82.55 180 top
X64  FFKDS/V1-5.08_MIDDLE  [FFKDS/V1-5,08-1_MIDDLE]  182.88,82.55 180 top
X65  FFKDS/V1-5.08_MIDDLE  [FFKDS/V1-5,08-1_MIDDLE]  177.8,82.55 180 top
X66  FFKDS/V1-5.08_MIDDLE  [FFKDS/V1-5,08-1_MIDDLE]  172.72,82.55 180 top
X67  FFKDS/V1-5.08_MIDDLE  [FFKDS/V1-5,08-1_MIDDLE]  167.64,82.55 180 top
X68  FFKDS/V1-5.08_MIDDLE  [FFKDS/V1-5,08-1_MIDDLE]  162.56,82.55 180 top
X69  FFKDS/V1-5.08_LAST  [FFKDS/V1-5,08-1_LAST]  157.48,82.55 180 top
X70  FFKDS/V1-5.08_FIRST  [FFKDS/V1-5,08-1_FIRST]  213.36,99.06 180 top
X71  FFKDS/V1-5.08_MIDDLE  [FFKDS/V1-5,08-1_MIDDLE]  208.28,99.06 180 top
X72  FFKDS/V1-5.08_MIDDLE  [FFKDS/V1-5,08-1_MIDDLE]  203.2,99.06 180 top
X73  FFKDS/V1-5.08_MIDDLE  [FFKDS/V1-5,08-1_MIDDLE]  198.12,99.06 180 top
X74  FFKDS/V1-5.08_MIDDLE  [FFKDS/V1-5,08-1_MIDDLE]  193.04,99.06 180 top
X75  FFKDS/V1-5.08_MIDDLE  [FFKDS/V1-5,08-1_MIDDLE]  187.96,99.06 180 top
X76  FFKDS/V1-5.08_MIDDLE  [FFKDS/V1-5,08-1_MIDDLE]  182.88,99.06 180 top
X77  FFKDS/V1-5.08_MIDDLE  [FFKDS/V1-5,08-1_MIDDLE]  177.8,99.06 180 top
X78  FFKDS/V1-5.08_MIDDLE  [FFKDS/V1-5,08-1_MIDDLE]  172.72,99.06 180 top
X79  FFKDS/V1-5.08_MIDDLE  [FFKDS/V1-5,08-1_MIDDLE]  167.64,99.06 180 top
X80  FFKDS/V1-5.08_MIDDLE  [FFKDS/V1-5,08-1_MIDDLE]  162.56,99.06 180 top
X81  FFKDS/V1-5.08_LAST  [FFKDS/V1-5,08-1_LAST]  157.48,99.06 180 top
X82  FFKDS/V1-5.08_MIDDLE  [FFKDS/V1-5,08-1_MIDDLE]  113.63,99.06 180 top
X83  FFKDS/V1-5.08_MIDDLE  [FFKDS/V1-5,08-1_MIDDLE]  108.55,99.06 180 top
X84  FFKDS/V1-5.08_MIDDLE  [FFKDS/V1-5,08-1_MIDDLE]  123.79,99.06 180 top
X85  FFKDS/V1-5.08_MIDDLE  [FFKDS/V1-5,08-1_MIDDLE]  118.71,99.06 180 top
X86  FFKDS/V1-5.08_MIDDLE  [FFKDS/V1-5,08-1_MIDDLE]  133.95,99.06 180 top
X87  FFKDS/V1-5.08_MIDDLE  [FFKDS/V1-5,08-1_MIDDLE]  128.87,99.06 180 top
X88  FFKDS/V1-5.08_FIRST  [FFKDS/V1-5,08-1_FIRST]  144.11,99.06 180 top
X89  FFKDS/V1-5.08_MIDDLE  [FFKDS/V1-5,08-1_MIDDLE]  139.03,99.06 180 top
XT1  FFKDS/V1-5.08-2  [FFKDS/V1-5.08-2]  243.21,8.89 0 top
XT2  FFKDS/V1-5.08-3  [FFKDS/V1-5.08-3]  269.24,99.06 180 top
XT3  FFKDS/V1-5.08-2  [FFKDS/V1-5.08-2]  12.7,99.06 180 top
XT4  FFKDS/V1-5.08-2  [FFKDS/V1-5.08-2]  227.33,99.06 180 top
XTAL1  25MHz  [SM49]  13.05,53.09 180 top
XTAL2  MC-306 32.768000kHz 12.5 +20.0-20.0  [MC306]  89.79,48.59 180 top
XTAL3  8MHz  [SM49]  164.68,72.39 0 top

## Tracks (layer width: path | path; a pad name or v marks a point on that pad's centre or on a via)
1V20
  Top 0.254: IC3.22 22.08,40.36 C15.1
+3V3  (via drill 0.4, 0.4 pad 0.55, 0.45, 0.5, 0.6, 0.6 pad 0.55)
  Top 0.203: C38.1 183.21,43.33 183.39,43.51
  Top 0.254: IC3.28 16.33,44.52 v16.14,44.7 | 150.47,70.74 IC5.100 151.8,70.77 152.53,71.5 C34.1 154.57,72.9 R38.2 | L4.1 R23.2 | IC5.75 148.84,57.91 149.1,58.17 152.4,58.17 153.82,56.75 C35.1 | v137.41,69.47 137.11,69.77 IC5.28 132.92,69.77 131.06,71.63 131.06,73.15 130.3,73.91 C37.1 | C43.1 135.21,52.94 IC5.50 135.21,58.12 v134.62,57.53 | C45.1 C43.1 | IC5.11 143.84,73.99 v144.4,74.55 145.92,74.55 | C43.1 135.49,52.47 135.89,52.07 135.89,47.62 135.25,46.99 135.25,43.53 135.35,43.43 | 145.92,74.55 146.34,74.55 | IC5.6 146.34,73.91 146.34,74.13 | 146.34,74.2 146.34,74.55 | 146.34,74.55 146.69,74.55 146.34,74.2 | 146.34,74.13 146.34,74.2 | 146.34,74.13 145.92,74.55
  Top 0.406: CON1.12 18.36,5.08 9.24,5.08 CON1.9 7.46,6.86 5.84,6.86 2.67,10.03 2.67,33.15 v3.81,34.29 R26.2 R28.2 R30.2 | v16.14,44.7 16.14,45.88 C17.1 18.43,45.99 18.8,46.35 18.8,48.26 20.57,50.04 27.63,50.04 C20.+ 28.7,50.29 | C18.1 260.8,87.31 L2.2 | C33.1 151.27,77.36 151.64,77.72 | 151.64,77.72 151.64,87.5 151.06,88.08 C14.+ | 151.64,77.72 151.64,74.04 152.78,72.9 154.57,72.9 | v108.2,55.88 108.08,56.01 L7.1 | C35.1 157.57,55.37 CON2.1 | C32.1 148.21,76.07 146.69,74.55 v144.4,74.55
  Top 0.61: C20.+ L3.1 | R96.2 43.15,43.43 46.19,43.43 | R97.2 46.19,43.43 | 46.19,43.43 49.24,43.43 | 49.24,43.43 R98.2 | 49.24,43.43 52.29,43.43 | 52.29,43.43 R99.2 | 52.29,43.43 53.59,43.43 55.42,41.6 C92.+ | R109.2 87.59,43.43 | 84.58,43.43 84.58,40.89 R108.2 | R110.2 90.64,43.43 | R111.2 93.69,43.43 | R23.2 290.95,103.75 287.83,100.64 C19.+ 283.16,99.57 281.05,99.57 | 260.86,87.25 L2.2 | R120.2 126.2,43.43 | R121.2 129.25,43.43 | R122.2 132.3,43.43 | R123.2 135.35,43.43 | R144.2 199.61,43.51 199.64,43.51 | R145.2 202.66,43.51 202.44,43.51 | R146.2 205.71,43.51 205.49,43.51 | R147.2 208.75,43.51 | R132.2 165.06,43.94 165.1,43.94 | R133.2 168.11,43.94 167.89,43.94 | R134.2 171.16,43.94 170.94,43.94 | R135.2 174.21,43.94 | L1.2 v224.28,45.21 | C32.1 C33.1 | C41.1 115.44,43.05 115.82,43.43 | C18.1 254.32,87.31 253.49,88.14 253.49,98.55 254.51,99.57 281.05,99.57 | C83.1 60.07,41.6 | C93.1 281.05,99.57
  Top 0.762: C14.+ L5.2 151.38,91.06 152.27,91.95 152.27,98.55 154.36,100.64 C19.+
  Top 1.016: L6.2 22.86,52.7 24.46,51.11 C20.+ 54.3,51.11 v56.13,49.28 C92.+ 60.07,41.6 60.53,41.6 62.36,43.43 84.58,43.43 87.59,43.43 90.64,43.43 93.69,43.43 115.82,43.43 120.4,43.43 | 120.4,43.43 C82.+ | 120.4,43.43 126.2,43.43 129.25,43.43 132.3,43.43 135.35,43.43 136.53,43.43 137.03,42.93 137.03,38.23 138.81,36.45 158.62,36.45 160.27,38.1 160.27,43.94 | 160.27,43.94 165.1,43.94 167.89,43.94 170.94,43.94 174.21,43.94 174.9,43.25 C12.+ 179.07,43.51 183.39,43.51 199.64,43.51 202.44,43.51 205.49,43.51 208.75,43.51 219.25,43.51 v219.33,43.43 | v159.26,48.13 160.27,47.12 160.27,43.94
  Bottom 0.254: v134.62,57.53 135.03,57.94 135.03,60.12 138.66,63.75 138.66,68.22 v137.41,69.47
  Bottom 0.406: v16.14,44.7 13.72,44.7 10.67,41.66 10.67,38.61 6.35,34.29 v3.81,34.29 | v137.41,69.47 140.97,69.47 141.48,69.98 141.48,74.3 141.99,74.8 144.15,74.8 v144.4,74.55 | v56.13,49.28 56.9,50.04 96.77,50.04 97.28,50.55 97.28,55.12 98.04,55.88 v108.2,55.88
  Bottom 1.016: CON2.1 158.84,48.55 v159.26,48.13 | v219.33,43.43 221.11,45.21 v224.28,45.21
+24V  (via drill 0.4, 0.45)
  Top 0.406: R48.1 v275.56,74.3 | R49.1 v275.56,71.75 | v275.56,69.22 R50.1 | v275.56,66.67 R51.1 | v275.56,62.87 R52.1 | v275.56,60.33 R53.1 | v275.56,57.78 R54.1 | v275.56,55.24 R55.1 | v275.56,51.44 R64.1 | v275.56,48.9 R65.1 | v275.56,46.35 R66.1 | R67.1 v275.56,43.81 | v275.56,40.01 R68.1 | v275.56,37.47 R69.1 | v275.56,34.92 R70.1 | v275.56,32.38 R71.1 | v275.56,28.57 R80.1 | v275.56,26.04 R81.1 | v275.56,23.5 R82.1 | v275.56,20.95 R83.1 | v275.56,17.14 R84.1 | v275.56,14.61 R85.1 | v275.56,12.06 R86.1 | v275.56,9.53 R87.1 | C57.1 v275.59,6.6
  Top 0.61: 295.44,9.19 IC8.10 | IC7.10 C68.1 298.12,30.15 294.39,26.42 EC3.+ 293.46,26.43 | v275.59,6.6 290.58,6.6 291.08,7.11 291.08,8.13 | 275.59,74.33 v275.56,74.3 275.56,75.44 276.06,75.95 293.19,75.95 293.7,75.44 EC1.+ | EC2.+ 295.78,49.02 296.19,49.43 C58.1 296.19,55.14 IC6.10
  Top 0.762: EC3.+ 293.45,24.46 291.08,22.1 291.08,8.14 C77.1 291.08,8.13 294.39,8.13 295.44,9.19
  Top 1.016: CON3.B1 308.19,69.34 305.65,71.88 | 305.65,71.88 EC1.+ 293.7,69.42 292.1,67.82 292.1,50.72 EC2.+ 292.1,47.33 292.1,27.76 EC3.+ | C59.1 305.64,71.87 305.65,71.88
  Bottom 0.406: 275.56,6.64 v275.59,6.6
  Bottom 0.61: v275.56,74.3 v275.56,71.75 v275.56,69.22 v275.56,66.67 v275.56,62.87 v275.56,60.33 v275.56,57.78 v275.56,55.24 v275.56,51.44 v275.56,48.9 v275.56,46.35 v275.56,43.81 v275.56,40.01 v275.56,37.47 v275.56,34.92 v275.56,32.38 v275.56,28.57 v275.56,26.04 v275.56,23.5 v275.56,20.95 v275.56,17.14 v275.56,14.61 v275.56,12.06 v275.56,9.53 275.56,6.64
ACTLED
  Top 0.254: IC3.27 16.83,43.94 17.34,44.45 19.3,44.45 19.9,45.05 R25.2
ADCIN0
  Top 0.203: IC5.23 137.84,74.85 139.06,76.07 R170.2
  Top 0.254: R170.2 139.79,77.35 C120.1
ADCIN1
  Top 0.203: IC5.24 137.34,77.19 C121.1 135.99,77.36 R171.2
ADCIN2
  Top 0.203: C122.1 134.56,77.27 134.49,77.2 134.49,76.58 136.84,74.23 IC5.25
  Top 0.254: C122.1 133.45,77.36 R172.2
ADCIN3
  Top 0.203: C123.1 131.32,76.2 131.57,75.95 131.57,71.88 132.68,70.77 IC5.26
  Top 0.305: R173.2 129.67,77.39 C123.1
ADCIN4
  Top 0.203: IC5.29 132.59,69.27 130.99,70.87 C138.1
  Top 0.254: R195.2 C138.1
ADCIN5
  Top 0.203: C139.1 R196.2 131.64,67.82 132.59,68.77 IC5.30
ADCIN6
  Top 0.203: C140.1 130.68,66.29 132.66,68.27 IC5.31
  Top 0.254: C140.1 129.62,65.54 R197.2
ADCIN7
  Top 0.203: C141.1 130.68,63.25 131.06,63.63 131.06,66.17 132.66,67.77 IC5.32
  Top 0.254: C141.1 129.62,63 R198.2
ADCIN8
  Top 0.203: R219.2 C155.1 130.68,60.2 131.7,61.21 131.7,65 132.97,66.27 IC5.35
ADCIN9
  Top 0.203: IC5.36 135.19,65.79 133.1,65.79 132.06,64.75 132.06,58.52 130.68,57.15 C156.1
  Top 0.254: C156.1 129.62,55.88 R220.2
ADCIN10
  Top 0.203: IC5.15 141.84,74.68 142.6,75.44 144.91,75.44 145.16,75.69 R221.2 | R221.2
  Top 0.254: R221.2 144.87,77.35 R221.2 C157.1
ADCIN11
  Top 0.203: IC5.16 141.34,75.43 142.11,76.2 R222.2
  Top 0.254: R222.2 142.33,77.35 C158.1
AGND  (via drill 0.4, 0.45)
  Top 0.254: IC5.20 139.34,73.91 139.84,73.91 | IC5.19 139.84,73.91 | 139.84,73.91 139.84,74.18 v140.08,74.42
  Top 0.305: R150.1 28.45,88.61 v28.45,87.38 | R151.1 38.61,88.61 v38.61,87.38 | R152.1 48.77,88.61 v48.77,87.38 | R153.1 58.93,88.61 v58.93,87.38 | R175.1 69.09,88.61 v69.09,87.38 | R176.1 79.25,88.61 v79.25,87.38 | R177.1 89.41,88.61 v89.41,87.38 | R178.1 99.57,88.61 v99.57,87.38 | R199.1 109.73,88.61 v109.73,87.38 | R200.1 119.89,88.61 v119.89,87.38 | R201.1 130.05,88.61 v130.05,87.38 | R202.1 140.21,88.61 v140.21,87.38 | C138.2 v127,70.87 | v127,69.34 C139.2 | v127,66.29 C140.2 | C141.2 v127,63.25 | C155.2 v127,60.2 | C156.2 v127,57.15 | v131.32,80.14 C123.2 | C122.2 134.46,80.05 v134.37,80.14 | C121.2 137.51,80.05 v137.41,80.14 | C157.2 146.65,80.05 v146.56,80.14 | C158.2 143.6,80.05 v143.51,80.14 | C120.2 v140.59,80.11 | R214.1 103.22,77.05 v103.25,77.09
  Top 0.406: v75.78,67.56 R189.1 | IC11.11 43.02,72.39 v43.53,71.88 | C124.2 C119.2 | R162.1 v29.3,77.22 | C143.2 C142.2 | IC14.11 117.68,72.14 C104.2 C105.2 | 26.25,96.23 C111.2 28.51,88.63 R150.1 | X45.1@1 36.41,96.23 C112.2 38.67,88.63 R151.1 | X47.1@1 46.63,88.69 C113.2 48.83,88.63 R152.1 | X49.1@1 56.79,88.69 C114.2 58.99,88.63 R153.1 | X51.1@1 66.95,88.69 C129.2 69.15,88.63 R175.1 | X53.1@1 77.11,88.69 C130.2 79.31,88.63 R176.1 | X55.1@1 87.27,88.69 C131.2 89.47,88.63 R177.1 | X57.1@1 97.43,88.69 C132.2 99.63,88.63 R178.1 | X83.1@1 107.59,88.69 C145.2 109.79,88.63 R199.1 | X85.1@1 117.75,88.69 C146.2 119.95,88.63 R200.1 | X87.1@1 127.91,88.69 C147.2 130.11,88.63 R201.1 | X89.1@1 138.07,88.69 C148.2 140.27,88.63 R202.1 | R188.1 53.98,69.06 v53.98,67.82 | R187.1 53.98,75.72 | 75.78,77.18 75.82,77.22 | R211.1 81.63,77.05
  Top 0.508: v21.46,85.72 R149.2 C108.2 v21.46,87.25 | C142.2 v67.06,66.55 | IC13.11 69.09,72.39 v69.34,72.14 | R212.1 81.63,67.66 v81.53,67.56 | C154.2 v95.76,65.02 | C153.2 v95.76,66.55 | IC15.11 v98.93,72.39 | R213.1 103.22,67.91 v103.12,67.82 | C106.2 v107.95,74.42 | IC9.2 108.12,70.95 v107.95,71.12 | C104.2 v119.13,66.55 | C105.2 v119.13,65.02
  Top 2.032: X43.1@1 26.25,96.23
  Bottom 2.032: X43.2@1 X43.1@1 | X45.2@1 X45.1@1 | X47.2@1 X47.1@1 | X49.2@1 X49.1@1 | X51.2@1 X51.1@1 | X53.2@1 X53.1@1 | X55.2@1 X55.1@1 | X57.2@1 X57.1@1 | X83.2@1 X83.1@1 | X85.2@1 X85.1@1 | X87.2@1 X87.1@1 | X89.2@1 X89.1@1 | X81.2@1 X80.2@1 X79.2@1 X78.2@1 X77.2@1 X76.2@1 X75.2@1 X74.2@1 X73.2@1 X72.2@1 X71.2@1 X70.2@1 | X81.1@1 X80.1@1 X79.1@1 X78.1@1 X77.1@1 X76.1@1 X75.1@1 X74.1@1 X73.1@1 X72.1@1 X71.1@1 X70.1@1
  other vias: 49.62,72.26 50.89,67.56 44.03,66.55 30.7,66.8 2.29,64.26 4.92,62.23 6.57,61.47 3.39,61.21 25.65,71.63 24.89,77.47 25.65,68.96 52.58,80.26 57.15,67.18 58.42,66.67 53.98,64.64 43.81,63.75 60.96,63.37 85.85,67.18 87.63,65.28 84.07,65.28 104.65,72.26 36.45,89.92 46.61,89.92 56.77,89.92 66.93,89.92 76.96,89.92 87.12,89.92 97.28,89.92 107.57,89.92 117.73,89.92 127.89,89.92 138.05,89.92 143.51,81.41 146.56,81.53 32.77,67.18 30.99,63.63 34.29,63.63 127.76,76.07 127.76,78.74 117.6,72.14 100.08,77.09 98.3,77.47 102.36,72.26 112.9,65.28 109.35,65.28 111.12,67.18 114.43,77.72 119.38,77.72 191.77,67.31 173.99,67.31 189.23,67.31 176.53,67.31 186.69,67.31 179.07,67.31 184.15,67.31 181.61,67.31 33.53,83.57 33.53,80.9 26.29,89.92 106.3,67.82 248.67,72.39 248.67,77.47 248.67,74.93 248.67,80.01 248.67,90.17 248.67,82.55 248.67,87.63 248.67,85.09 39.75,63.75 46.86,63.75 50.8,63.75 50.93,69.09 52.58,75.69 51.05,75.69 60.83,77.72 60.83,80.26 66.93,77.6 67.82,78.74 69.98,78.74 69.98,77.6 77.09,75.69 80.26,75.69 89.79,78.36 94.36,84.07 104.65,84.07 114.81,84.07 125.09,84.07 145.29,84.33 145.29,88.9 16.6,61.21 13.17,61.21 19.4,71.88 19.4,70.36 19.4,69.09 19.4,67.82 19.4,66.29 11.27,71.88 11.27,70.36 11.27,69.09 11.27,67.82 11.27,66.29 21.21,96.27 21.21,93.73 21.21,91.19 21.21,98.81 194.31,67.31 196.85,67.31 199.39,67.31 201.93,67.31 204.47,67.31 207.01,67.31 209.55,67.31 210.82,69.85 213.36,69.85 220.98,69.85 224.79,69.85 228.6,69.85 232.92,69.85 234.95,69.85 237.49,69.85 240.03,69.85 242.57,69.85 246.38,69.85 220.98,73.66 220.98,80.01 233.68,79.88 220.98,76.71 87,73.03 91.06,64.77 101.6,64.52 106.3,63.37 171.32,67.31 169.04,67.31 232.92,73.91 234.95,73.91 237.49,73.91 240.03,73.91 243.33,82.04 242.57,84.33 237.62,84.33 225.55,82.04
  pour Bottom (isolate 0.508, rank 4): 5.84,107.19 5.84,102.23 0.51,102.23 0.51,60.2 121.79,60.2 122.43,59.56 122.43,56.64 122.94,56.13 131.83,56.13 131.83,60.2 250.19,60.33 250.19,107.19
  pour Top (isolate 0.508, rank 4): 5.84,107.19 5.84,102.23 0.51,102.23 0.51,60.2 247.4,60.71 247.4,66.29 250.19,69.09 250.19,107.19
BOOT0
  Top 0.203: IC5.94 154.48,67.77 R39.2
BTM-!ATC
  Top 0.203: U1.6 294.67,100.81 294.26,101.22 289.69,101.22 287.27,98.81 287.27,81.03 286.31,80.06 255.57,80.06 254.16,78.65 254.16,66.2 253.23,65.27 IC5.89
BTM-LINK
  Top 0.203: U1.15 288.46,88.69 287.78,88.01 287.78,81.02 286.47,79.7 255.72,79.7 254.51,78.5 254.51,65.89 253.4,64.77 IC5.88
BTM-RX
  Top 0.203: IC5.86 253.51,63.77 255.23,65.49 255.23,78.2 256.02,78.99 286.89,78.99 291.34,83.44 298.15,83.44 299.17,84.45 U1.22
BTM-TX
  Top 0.203: IC5.87 253.4,64.27 254.87,65.74 254.87,78.35 255.87,79.35 286.61,79.35 291.08,83.82 297.05,83.82 297.67,84.43 U1.21
BTM-WORK_STATUS  (via drill 0.45)
  Top 0.254: U1.16 289.67,85.19 v289.56,85.09 | v285.75,87.76 R34.1
  Bottom 0.203: v285.75,87.76 285.75,85.6 286.26,85.09 v289.56,85.09
DIN1  (via drill 0.4, 0.45)
  Top 0.203: IC5.97 149.66,69.27 149.35,68.96 149.35,67.42 147.9,65.97 143.36,65.97 142.26,67.07 142.26,67.53 v142.23,67.56
  Top 0.254: OK7.16 42.51,37.59 v42.64,37.59 42.64,39.12 | 42.64,39.12 R96.1 | 42.64,39.12 42.64,39.13 C78.1
  Bottom 0.203: v42.64,37.59 42.64,40.1 43.43,40.89 53.85,40.89 60.2,47.24 141.86,47.24 142.8,48.18 142.8,58.8 | 142.8,59.25 142.8,58.8 | v142.23,67.56 142.8,66.99 142.8,58.8
DIN2  (via drill 0.4, 0.45)
  Top 0.203: 149.53,69.77 IC5.98 | 149.1,69.34 149.53,69.77 | v142.75,68.58 143.13,68.2 143.13,66.8 143.61,66.32 147.75,66.32 148.97,67.54 148.97,69.22 149.53,69.77
  Top 0.254: OK7.14 45.05,37.47 v44.67,37.85 C79.1 R97.1
  Bottom 0.203: v44.67,37.85 44.67,39.84 45.36,40.54 54,40.54 60.35,46.89 142.04,46.89 143.15,48.01 143.15,68.17 v142.75,68.58
DIN3  (via drill 0.4, 0.45)
  Top 0.203: IC5.1 148.84,70.27 v148.29,69.72
  Top 0.254: OK7.12 47.59,37.72 v47.72,37.85 C80.1 R98.1
  Bottom 0.203: v47.72,37.85 47.72,39.59 48.31,40.18 54.15,40.18 60.5,46.53 142.18,46.53 143.51,47.86 143.51,68.45 145.18,70.13 147.89,70.13 v148.29,69.72
DIN4  (via drill 0.4, 0.45)
  Top 0.203: IC5.2 148.34,70.87 147.28,69.81 v147.28,69.47
  Top 0.254: OK7.10 50.13,37.21 v50.77,37.85 C81.1 R99.1
  Bottom 0.203: v50.77,37.85 50.77,39.34 51.26,39.83 54.3,39.83 60.65,46.18 142.33,46.18 143.87,47.71 143.87,68.31 145.21,69.65 147.1,69.65 v147.28,69.47
DIN5  (via drill 0.4, 0.45)
  Top 0.203: IC5.3 147.83,72.39 147.83,70.99 146.33,69.5 v146.33,68.99
  Top 0.305: OK8.16 84.42,37.21 v83.78,37.85 83.78,39.38 | 83.78,39.38 R108.1 | 83.78,39.38 C84.1
  Bottom 0.203: v83.78,37.85 83.78,40.35 84.58,41.15 92.96,41.15 97.54,45.72 142.38,45.72 144.22,47.56 144.22,68.16 145.22,69.16 146.17,69.16 v146.33,68.99
DIN6  (via drill 0.4, 0.45)
  Top 0.203: IC5.4 147.34,71.08 145.45,69.19 v145.45,68.42
  Top 0.305: OK8.14 86.96,37.72 v86.83,37.85 86.83,39.38 | 86.83,39.38 C85.1 | 86.83,39.38 R109.1
  Bottom 0.203: v86.83,37.85 86.83,40.1 87.53,40.79 93.22,40.79 97.79,45.36 142.52,45.36 144.58,47.42 144.58,60.28 144.58,60.29 144.58,67.55 v145.45,68.42
DIN7  (via drill 0.4, 0.45)
  Top 0.203: IC5.5 146.84,71.08 144.77,69.01 144.77,67.94 145.13,67.58 146.03,67.58 v146.41,67.96
  Top 0.305: OK8.12 89.5,37.47 v89.12,37.85 C86.1 | C86.1 R110.1 | C86.1
  Bottom 0.203: v89.12,37.85 89.12,40.1 89.46,40.44 93.47,40.44 98.04,45.01 142.67,45.01 144.93,47.27 144.93,60.14 144.94,60.14 144.94,66.94 145.73,67.74 | 145.73,67.74 | 145.73,67.74 145.95,67.96 v146.41,67.96
DIN8  (via drill 0.4, 0.45)
  Top 0.203: IC5.38 141.5,64.77 142.76,63.5 144.31,63.5 v145.62,62.2
  Top 0.305: OK8.10 92.04,37.72 v92.17,37.85 C87.1 R111.1
  Bottom 0.203: v92.17,37.85 92.17,38.63 98.19,44.65 142.82,44.65 145.29,47.12 145.29,59.99 145.29,61.87 v145.62,62.2